# EAGLE design RH010.1 (EAGLE 7.1.0)
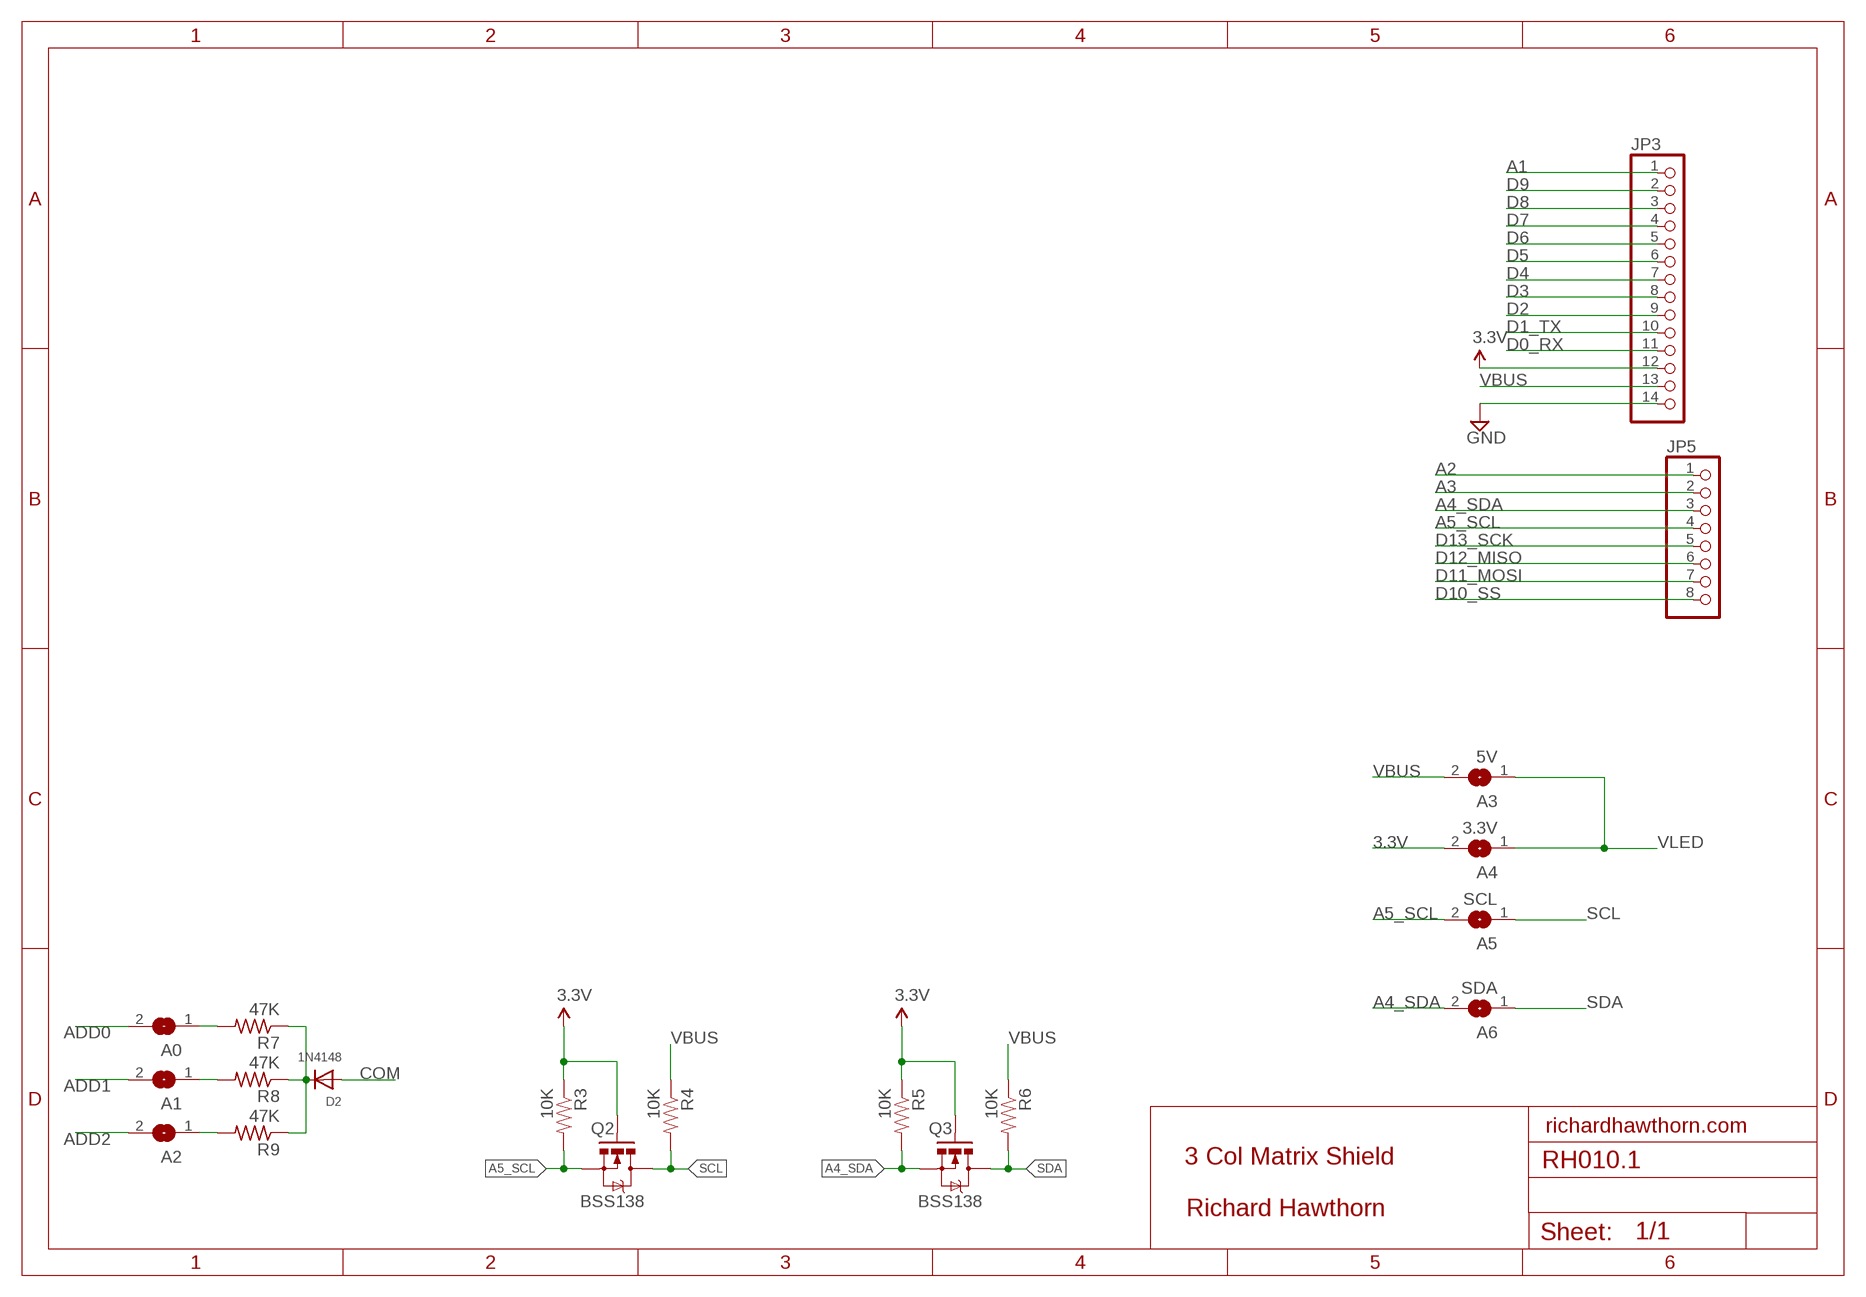
[diagram p0: schematic, sheet 1, part 1 of 2]
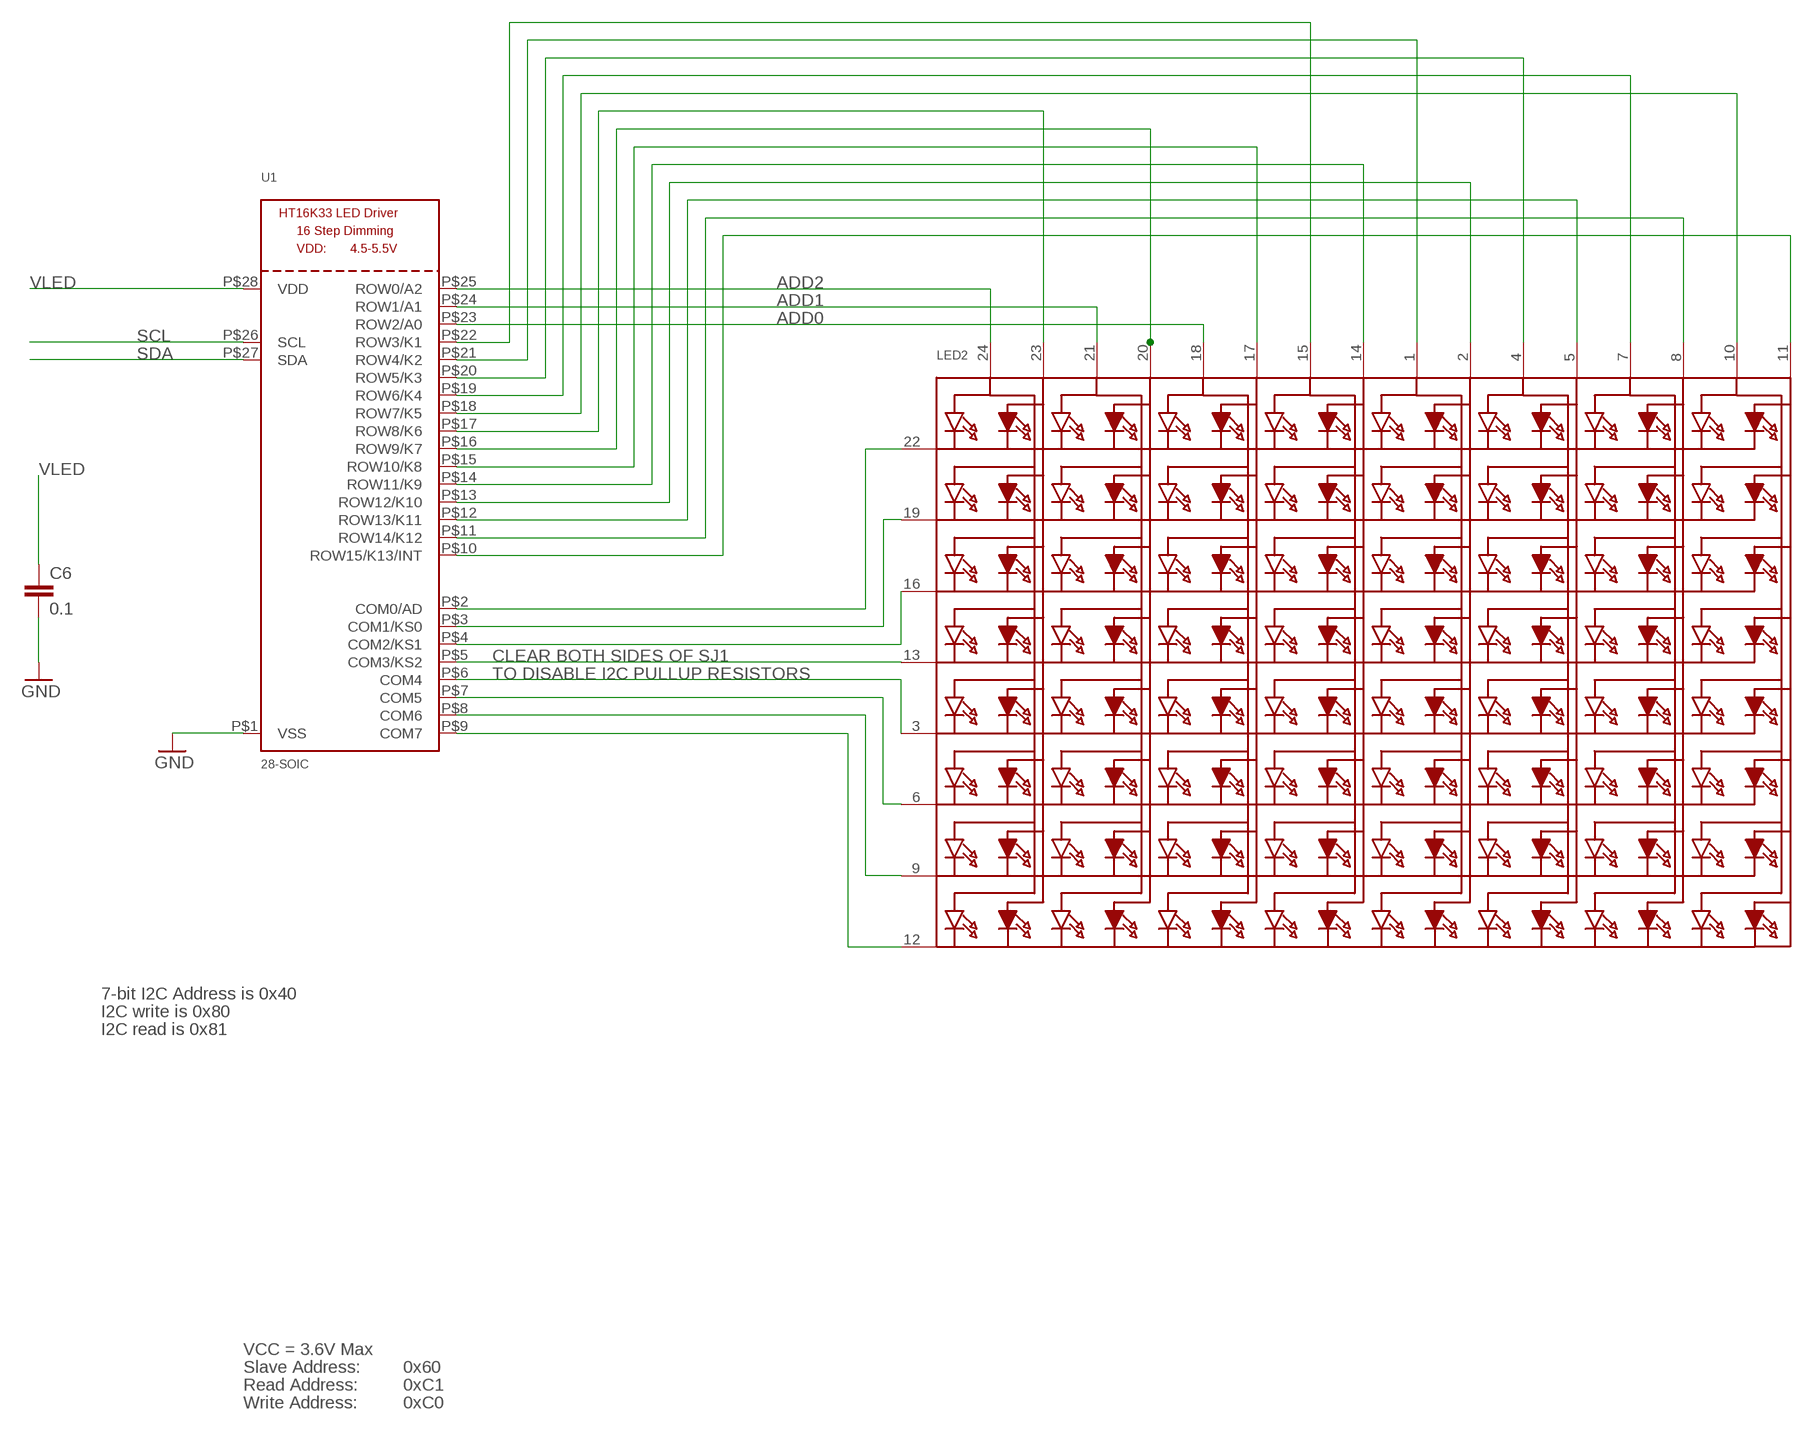
[diagram p1: schematic, sheet 1, part 2 of 2]

## Parts
A0  SOLDERJUMPERREFLOW_NOPASTE  [SOLDERJUMPER_REFLOW_NOPASTE]
A1  SOLDERJUMPERREFLOW_NOPASTE  [SOLDERJUMPER_REFLOW_NOPASTE]
A2  SOLDERJUMPERREFLOW_NOPASTE  [SOLDERJUMPER_REFLOW_NOPASTE]
A3  5V  SOLDERJUMPERREFLOW_NOPASTE  [SOLDERJUMPER_REFLOW_NOPASTE]
A4  3.3V  SOLDERJUMPERREFLOW_NOPASTE  [SOLDERJUMPER_REFLOW_NOPASTE]
A5  SCL  SOLDERJUMPERREFLOW_NOPASTE  [SOLDERJUMPER_REFLOW_NOPASTE]
A6  SDA  SOLDERJUMPERREFLOW_NOPASTE  [SOLDERJUMPER_REFLOW_NOPASTE]
C6  0.1  CAP0603-CAP  [0603-CAP]
D2  1N4148  DIODESOD-323F  [SOD-323F]
JP3  PINHD-1X14  [1X14]
JP5  PINHD-1X8  [1X08]
LED2  DISP_SEGMENT_8X8_BICOLOR_ROWCATHODEMI2A883XX  [SEGMENT_BICOL_BL-M12A883XX]
Q2  BSS138  MOSFET-NCHANNELSMD  [SOT23-3]
Q3  BSS138  MOSFET-NCHANNELSMD  [SOT23-3]
R3  10K  RESISTOR0603-RES  [0603-RES]
R4  10K  RESISTOR0603-RES  [0603-RES]
R5  10K  RESISTOR0603-RES  [0603-RES]
R6  10K  RESISTOR0603-RES  [0603-RES]
R7  47K  R-US_R0805  [R0805]
R8  47K  R-US_R0805  [R0805]
R9  47K  R-US_R0805  [R0805]
U1  28-SOIC  HT16K33_SOP28  [SOP28_300MIL]

## Nets
3.3V: A4.2 JP3.12 Q2.1(G) Q3.1(G) R3.1 R5.1
A1: JP3.1
A2: JP5.1
A3: JP5.2
A4_SDA: A6.2 JP5.3 Q3.2(S) R5.2
A5_SCL: A5.2 JP5.4 Q2.2(S) R3.2
ADD0: A0.2 LED2.18(A5) U1.P$23(ROW2/A0)
ADD1: A1.2 LED2.21(A3) U1.P$24(ROW1/A1)
ADD2: A2.2 LED2.24(A1) U1.P$25(ROW0/A2)
COM: D2.A LED2.22(K1) U1.P$2(COM0/AD)
D0_RX: JP3.11
D1_TX: JP3.10
D2: JP3.9
D3: JP3.8
D4: JP3.7
D5: JP3.6
D6: JP3.5
D7: JP3.4
D8: JP3.3
D9: JP3.2
D10_SS: JP5.8
D11_MOSI: JP5.7
D12_MISO: JP5.6
D13_SCK: JP5.5
GND [power]: C6.2 JP3.14 U1.P$1(VSS)
N$1: LED2.12(K8) U1.P$9(COM7)
N$2: LED2.9(K7) U1.P$8(COM6)
N$3: LED2.6(K6) U1.P$7(COM5)
N$5: A0.1 R7.2
N$7: LED2.3(K5) U1.P$6(COM4)
N$8: LED2.13(K4) U1.P$5(COM3/KS2)
N$9: LED2.16(K3) U1.P$4(COM2/KS1)
N$10: LED2.19(K2) U1.P$3(COM1/KS0)
N$12: LED2.8(A14) U1.P$11(ROW14/K12)
N$13: LED2.5(A12) U1.P$12(ROW13/K11)
N$15: LED2.10(A15) U1.P$18(ROW7/K5)
N$16: LED2.7(A13) U1.P$19(ROW6/K4)
N$17: D2.C R7.1 R8.1 R9.1
N$18: A2.1 R9.2
N$19: A1.1 R8.2
N$20: LED2.1(A9) U1.P$21(ROW4/K2)
N$21: LED2.11(A16) U1.P$10(ROW15/K13/INT)
N$26: LED2.15(A7) U1.P$22(ROW3/K1)
N$35: LED2.4(A11) U1.P$20(ROW5/K3)
N$38: LED2.23(A2) U1.P$17(ROW8/K6)
N$39: LED2.20(A4) U1.P$16(ROW9/K7)
N$40: LED2.14(A8) U1.P$14(ROW11/K9)
N$41: LED2.17(A6) U1.P$15(ROW10/K8)
N$42: LED2.2(A10) U1.P$13(ROW12/K10)
SCL: A5.1 Q2.3(D) R4.2 U1.P$26(SCL)
SDA: A6.1 Q3.3(D) R6.2 U1.P$27(SDA)
VBUS [power]: A3.2 JP3.13 R4.1 R6.1
VLED [power]: A3.1 A4.1 C6.1 U1.P$28(VDD)

## Notes on the sheet
- CLEAR BOTH SIDES OF SJ1
- TO DISABLE I2C PULLUP RESISTORS
- 7-bit I2C Address is 0x40
- I2C write is 0x80
- I2C read is 0x81
- richardhawthorn.com
- 3 Col Matrix Shield
- Richard Hawthorn
- VCC = 3.6V Max
- Slave Address: | 0x60
- Read Address: | 0xC1
- Write Address: | 0xC0

## Library data of the parts
A0 A1-A6 = microbuilder:SOLDERJUMPER: SMD Solder JUMPER Solder the two pads together to create a connection, or remove the solder to break it. REFLOW - Use this footprint for solder paste and reflow ovens. WAVE - Use this footprint for hand-soldering (larger pads). CLOSED - Has a trace between the two pads to ensure it is closed by default. The trace needs to be cut to disable the jumper, and can be closed again by creating a solder bridge between the two pads.
C6 = LowPowerLab:CAP: Capacitor Standard 0603 ceramic capacitor, and 0.1" leaded capacitor.
D2 = adafruit:DIODE: Diode SMADIODE - SMA Surface Mount Package 20V 1A Schottky Diode Digikey: 641-1014-6-ND DO-1N4148 - Through Hole Small Current Diode SOD-123 20V 1 A (.5mV Vf) Schottky Diode - Digikey: MBRX120TPMSCT-ND SOD-323 10V 570mA (.38mV Vf, 3ns) Schottky Diode - Digikey: ZLLS410CT-ND SOD-523 30V 30mA Schottky Diode (RB751S-40TE61) - Digikey: RB751S-40TE61CT-ND SOT23-R/W - SOT23 Package (R = Solder Paste/Reflow Ovens, W = Hand-Soldering) BAT54Film 40V 300mA - Digikey: 497-7162-1-ND
JP3 = pinhead:PINHD-1X14: PIN HEADER
JP5 = pinhead:PINHD-1X8: PIN HEADER
LED2 = microbuilder:DISP_SEGMENT_8X8_BICOLOR_ROWCATHODE: 8x8 Bi-Color LED Segment Displays: Row = Cathode 1.2" Bi-Color 8x8 Matrix, 3.0mm Square LEDs - BL-M12A883XX
Q2 Q3 = SparkFun:MOSFET-NCHANNEL
R3-R6 = SparkFun:RESISTOR: Resistor Basic schematic elements and footprints for 0603, 1206, and PTH resistors.
R7-R9 = adafruit:R-US_: RESISTOR, American symbol
U1 = microbuilder:HT16K33_SOP28

## Net classes
1 power: width 0.381 mm, clearance 0.254 mm

## Board
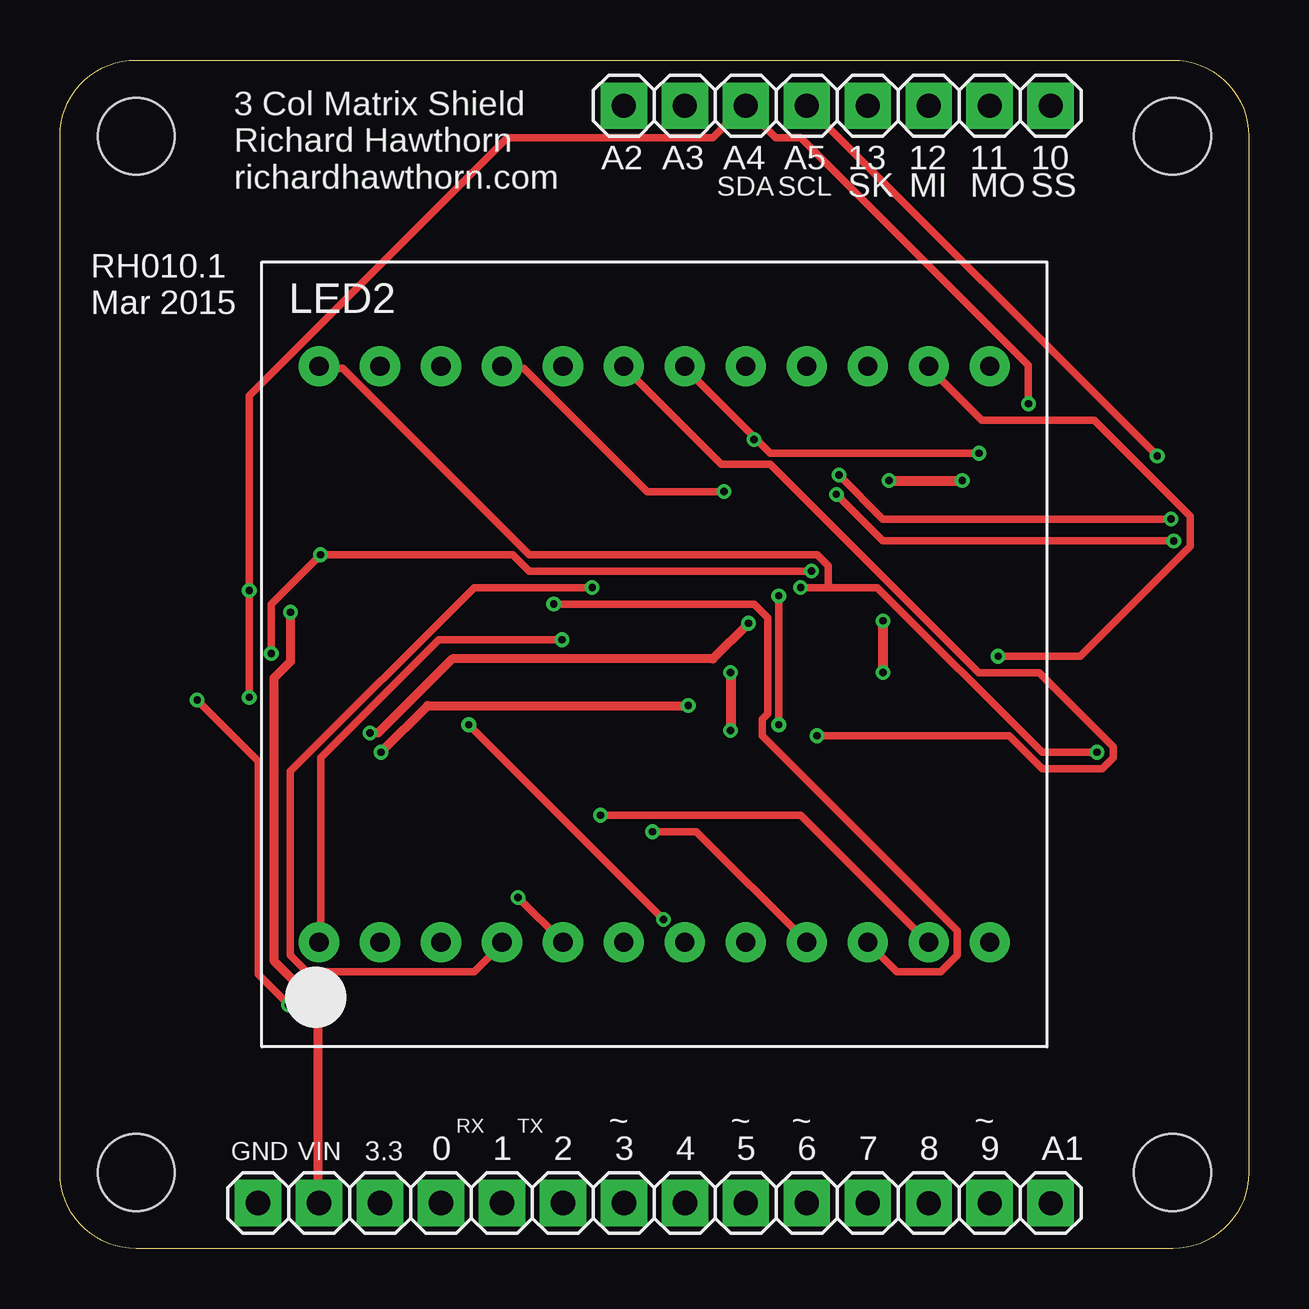
[diagram p2: board, top side]
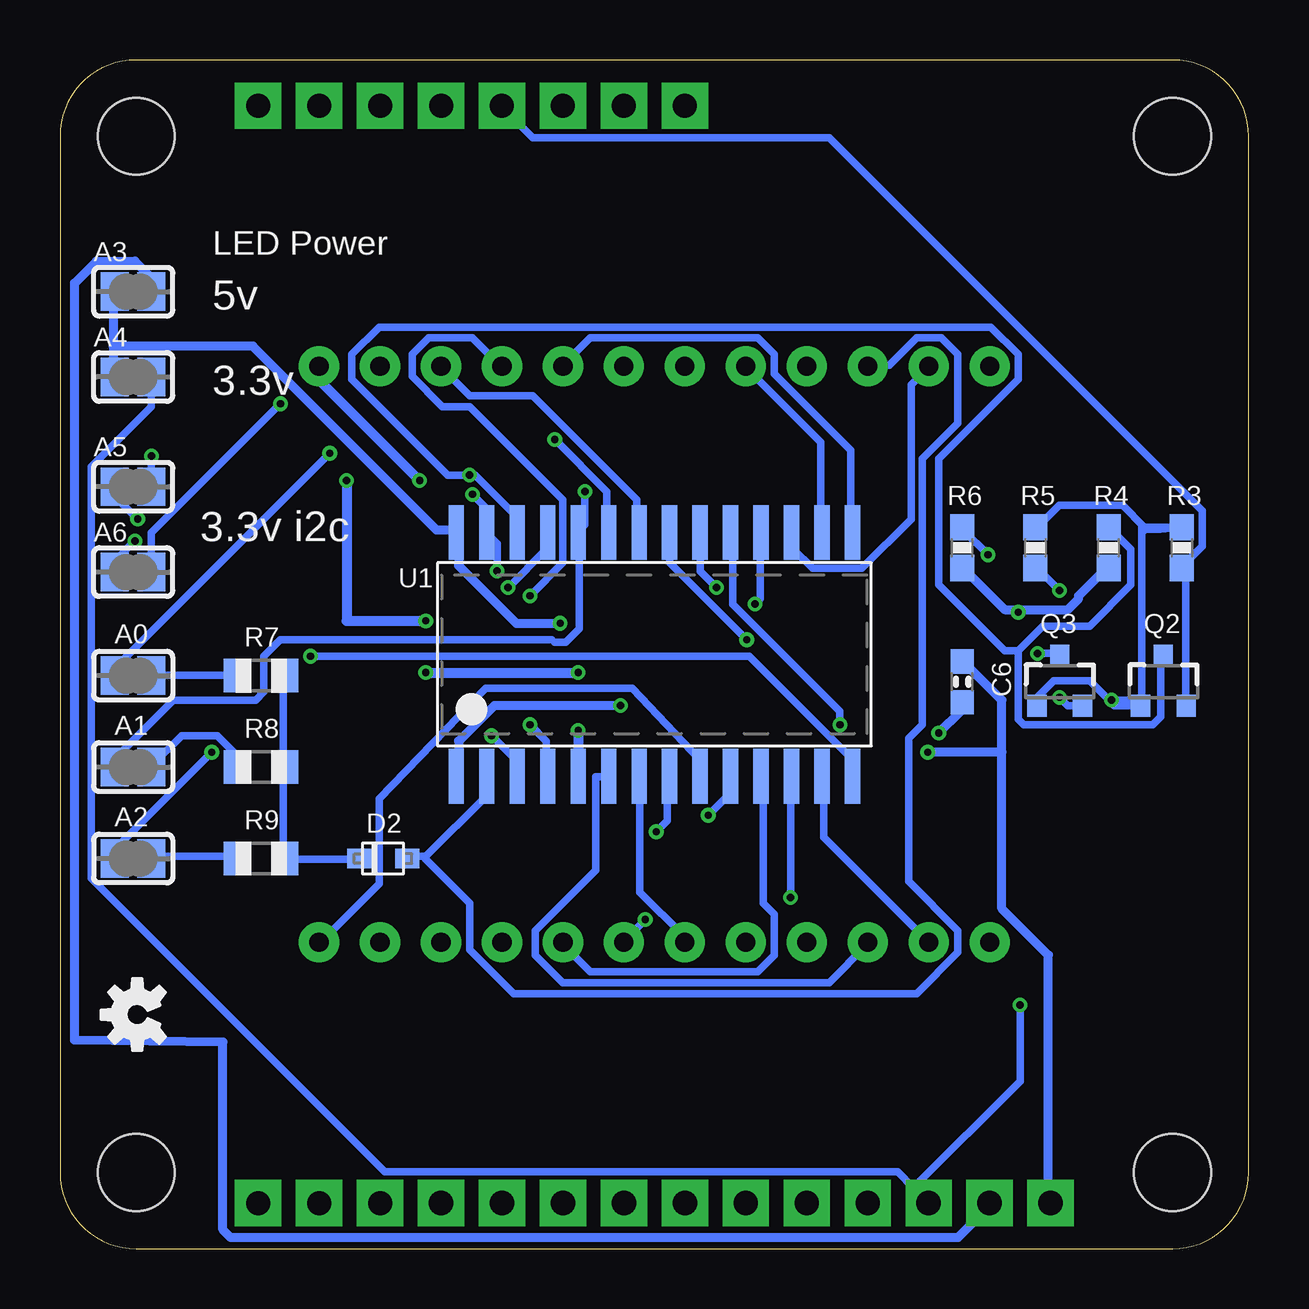
[diagram p3: board, bottom side, seen from below]

Size 49.53 x 49.53 mm. Coordinates in mm from the lower left corner, seen from the top.
Outline: 0,3.17 0,46.35 arc-90 3.17,49.53 46.35,49.53 arc-90 49.53,46.35 49.53,3.17 arc-90 46.35,0 3.17,0 arc-90 0,3.17
Copper layers (1*16): Top 0.035mm / dielectric 1.5mm / Bottom 0.035mm
Design rules "ITEADstudio_DRC *": minimum track width 12mil, minimum drill 12mil, track to track 6mil, track to pad 6mil, pad to pad 6mil, via to via 6mil, smd to smd 0mil, copper to edge 10mil, drill to drill 10mil, minimum pad ring 10mil, minimum via ring 6mil, stop-mask expansion 2mil, vias tented up to drill 100mil, thermal gap 15mil
Holes 3.2 mm at 3.17,3.17 46.35,3.17 3.17,46.35 46.35,46.35
tKeepout: area 0,0 to 5.7,5.7; area 43.8,0 to 49.5,5.7; area 43.8,43.8 to 49.5,49.5; area 0,43.8 to 5.7,49.5
bKeepout: area 0,43.8 to 5.7,49.5; area 43.8,43.8 to 49.5,49.5; area 43.8,0 to 49.5,5.7; area 0,0 to 5.7,5.7
tRestrict: area 24.3,8.9 to 29.1,12.8; area 5.8,16.9 to 6.9,18.5; area 5.2,9.7 to 6.7,10.4
bRestrict: area 27.4,17.7 to 29.2,18.7; area 21.1,13.8 to 22.9,14.9; area 21.6,12.6 to 22.1,13.2; area 20.7,12.6 to 21.2,13.2; area 20.2,12.8 to 20.7,13.5; area 20.1,13.4 to 20.6,14; area 26.5,18.9 to 27.1,19.5; area 26.5,17.9 to 27.1,18.5; area 27.5,19.1 to 28,19.8; area 27.9,18.8 to 29.1,19.6

### Footprints (pad centres in the part's own frame; a part is rotated, then mirrored left to right if it is on the bottom)
SOLDERJUMPER_REFLOW_NOPASTE = smd 1.168 x 1.6: 1 -0.762,0; 2 0.762,0
0603-CAP = smd 1.016 x 0.965: 1 -0.85,0; 2 0.85,0
SOD-323F = smd 1 x 0.8: A -1,0; C 1,0
1X14 = drill 1 pad 1.93 square: 1 -16.51,0; 2 -13.97,0; 3 -11.43,0 | drill 1.016 pad 1.93 square: 4 -8.89,0; 5 -6.35,0; 6 -3.81,0; 7 -1.27,0; 8 1.27,0; 9 3.81,0; 10 6.35,0; 11 8.89,0; 12 11.43,0; 13 13.97,0; 14 16.51,0
1X08 = drill 1 pad 1.93 square: 1 -8.89,0; 2 -6.35,0; 3 -3.81,0; 4 -1.27,0; 5 1.27,0; 6 3.81,0; 7 6.35,0; 8 8.89,0
SEGMENT_BICOL_BL-M12A883XX = drill 0.8 pad 1.676: 1 -13.97,-12; 2 -11.43,-12; 3 -8.89,-12; 4 -6.35,-12; 5 -3.81,-12; 6 -1.27,-12; 7 1.27,-12; 8 3.81,-12; 9 6.35,-12; 10 8.89,-12; 11 11.43,-12; 12 13.97,-12; 13 13.97,12; 14 11.43,12; 15 8.89,12; 16 6.35,12; 17 3.81,12; 18 1.27,12; 19 -1.27,12; 20 -3.81,12; 21 -6.35,12; 22 -8.89,12; 23 -11.43,12; 24 -13.97,12
SOT23-3 = smd 0.8 x 0.9: 1 -0.95,-1; 2 0.95,-1; 3 0,1.1
0603-RES = smd 1.1 x 1: 1 -0.85,0; 2 0.85,0
R0805 = smd 1.1 x 1.4: 1 -1,0; 2 1,0
SOP28_300MIL = smd 0.635 x 2.286: P$1 -8.255,-5.08; P$2 -6.985,-5.08; P$3 -5.715,-5.08; P$4 -4.445,-5.08; P$5 -3.175,-5.08; P$6 -1.905,-5.08; P$7 -0.635,-5.08; P$8 0.635,-5.08; P$9 1.905,-5.08; P$10 3.175,-5.08; P$11 4.445,-5.08; P$12 5.715,-5.08; P$13 6.985,-5.08; P$14 8.255,-5.08; P$15 8.255,5.08; P$16 6.985,5.08; P$17 5.715,5.08; P$18 4.445,5.08; P$19 3.175,5.08; P$20 1.905,5.08; P$21 0.635,5.08; P$22 -0.635,5.08; P$23 -1.905,5.08; P$24 -3.175,5.08; P$25 -4.445,5.08; P$26 -5.715,5.08; P$27 -6.985,5.08; P$28 -8.255,5.08

### Placement (x,y rotation side)
A0  46.48,23.88 180 bottom
A1  46.48,20.07 180 bottom
A2  46.48,16.26 180 bottom
A3  46.48,39.88 0 bottom
A4  46.48,36.32 0 bottom
A5  46.48,31.75 0 bottom
A6  46.48,28.19 0 bottom
C6  11.94,23.62 90 bottom
D2  36.07,16.26 180 bottom
JP3  24.77,1.91 180 top
JP5  32.38,47.62 0 top
LED2  24.77,24.77 0 top
Q2  3.56,23.62 0 bottom
Q3  7.87,23.62 0 bottom
R3  2.79,29.21 270 bottom
R4  5.84,29.21 90 bottom
R5  8.89,29.21 270 bottom
R6  11.94,29.21 90 bottom
R7  41.15,23.88 180 bottom
R8  41.15,20.07 180 bottom
R9  41.15,16.26 180 bottom
U1  24.77,24.77 0 bottom
U$3  [OSHW-LOGO-S]  46.32,9.75 90 bottom

### Tracks (layer width: path | path; a pad name or v marks a point on that pad's centre or on a via)
3.3V  (via drill 0.3)
  Top 0.305: v5.71,22.86 8.26,20.32 8.26,11.43 v9.53,10.16
  Bottom 0.305: A4.2 45.72,35.09 48.23,32.58 48.23,15.43 36.01,3.2 14.63,3.2 13.97,2.54 | 4.57,22.63 5.6,22.63 5.77,22.8 | 5.77,22.8 6.63,23.66 8.12,23.66 8.8,22.97 8.8,22.63 Q3.1 | 4.34,30.06 2.86,30.06 | 4.34,30.06 5.26,30.98 7.89,30.98 8.8,30.06 R5.1 | 4.46,29.84 4.46,30.06 4.34,30.06 | 4.46,29.84 4.46,22.86 | 4.46,22.86 4.46,22.75 | 4.46,22.86 4.45,22.86 Q2.1 | 4.46,22.86 v5.71,22.86 5.77,22.8 | R3.1 3.68,29.97 4.32,29.97 4.45,29.84 4.46,29.84 | v9.53,10.16 9.53,6.99 13.97,2.54 | 13.97,2.54 JP3.12
A4_SDA  (via drill 0.3)
  Top 0.305: v7.89,22.97 v7.89,27.43 7.89,35.55 18.63,46.29 27.2,46.29 28.46,47.55 JP5.3 28.57,47.55 29.83,46.29 30.86,46.29 40.35,36.8 v40.35,35.2
  Bottom 0.305: v7.89,22.97 7.54,22.63 6.97,22.63 Q3.2 | v7.89,27.43 8.8,28.35 R5.2 | A6.2 45.72,29.83 v40.35,35.2
A5_SCL  (via drill 0.3)
  Top 0.305: v45.72,33.03 31.2,47.55 JP5.4
  Bottom 0.305: Q2.2 2.63,22.63 2.63,28.23 2.74,28.35 R3.2 2.74,28.46 1.94,29.26 1.94,30.75 17.49,46.29 29.83,46.29 31.09,47.55 JP5.4 | v45.72,33.03 A5.2
ADD0  (via drill 0.3)
  Top 0.305: v38.29,33.15 29.6,33.15 28.98,33.78 | 28.98,33.78 26.06,36.69 LED2.18 | v28.92,33.72 28.98,33.78
  Bottom 0.305: v38.29,33.15 47.21,24.23 47.21,23.89 A0.2 | v28.92,33.72 26.75,31.55 26.75,29.95 U1.P$23
ADD1  (via drill 0.3)
  Top 0.305: v27.66,31.55 24.46,31.55 19.32,36.69 18.52,36.69 LED2.21
  Bottom 0.305: A1.2 47.21,20.12 47.21,20.46 44.81,22.86 41.38,22.86 41.03,23.2 41.03,24.69 40.35,25.38 29.03,25.38 28.92,25.26 28.46,25.26 27.89,25.83 27.89,29.83 U1.P$24 27.89,29.95 27.66,30.18 v27.66,31.55
ADD2  (via drill 0.3)
  Top 0.305: v43.2,20.69 40.92,20.69 34.06,27.55 32,27.55 | v30.86,27.55 32,27.55 | 32,27.55 32,28.46 31.55,28.92 19.55,28.92 11.77,36.69 10.86,36.69 LED2.24
  Bottom 0.305: v43.2,20.69 47.21,16.69 47.21,16.34 A2.2 | v30.86,27.55 29.26,29.15 29.26,29.83 U1.P$25
COM
  Bottom 0.305: 34.29,16.34 34.98,16.34 D2.A | 34.29,16.34 31.77,18.86 31.77,19.66 U1.P$2 | LED2.22 15.77,36.8 14.97,36.8 13.83,37.95 12.8,37.95 12.12,37.26 12.12,34.4 13.6,32.92 13.6,21.83 14.17,21.26 14.17,15.32 12.12,13.26 12.12,12.34 13.83,10.63 30.63,10.63 32.46,12.46 32.46,14.4 34.29,16.23 34.29,16.34
GND  (via drill 0.3)
  Top 0.381: v26.18,22.63 15.32,22.63 v13.37,20.69
  Bottom 0.381: 10.29,20.69 10.29,14.17 8.34,12.23 8.34,1.94 JP3.14 | 10.29,20.69 10.29,22.86 11.89,24.46 C6.2 | v26.18,22.63 31.43,22.63 32.92,21.14 32.92,19.77 U1.P$1 | 10.29,20.69 v13.37,20.69
N$1
  Bottom 0.305: U1.P$9 22.86,20.34 25.69,23.34 31.8,23.34 36.23,18.75 36.23,15.2 38.63,12.8 LED2.12
N$2  (via drill 0.3)
  Top 0.305: v24.69,17.37 26.52,17.37 31.09,12.8 LED2.9
  Bottom 0.305: v24.69,17.37 24.23,17.83 24.23,19.66 U1.P$8
N$3
  Bottom 0.305: U1.P$7 25.38,19.66 25.38,14.86 23.55,13.03 23.55,12.8 LED2.6
N$5
  Bottom 0.305: R7.2 42.18,23.89 A0.1
N$7
  Bottom 0.305: U1.P$6 26.75,19.66 27.2,19.66 27.2,15.77 29.72,13.26 29.72,12.23 28.57,11.09 17.49,11.09 15.89,12.69 LED2.3
N$8  (via drill 0.3)
  Top 0.406: v34.54,32 v37.59,32 | v34.29,26.16 v34.29,24 | v27.94,24 v27.94,21.59
  Bottom 0.406: LED2.13 38.61,36.07 v34.54,32 | v37.59,32 37.59,26.16 v34.29,26.16 | v34.29,24 v27.94,24 | v27.94,21.59 U1.P$5
N$9  (via drill 0.3)
  Top 0.305: v29.95,27.2 v29.95,21.83
  Bottom 0.305: v29.95,21.83 29.26,21.14 29.26,19.77 U1.P$4 | v29.95,27.2 28.57,28.57 28.57,31.2 32.46,35.09 33.6,35.09 34.86,36.35 34.86,37.26 34.18,37.95 32.35,37.95 31.2,36.8 LED2.16
N$10  (via drill 0.3)
  Top 0.305: v31.55,21.37 39.55,21.37 40.92,20 43.43,20 43.89,20.46 43.89,20.92 40.8,24 38.29,24 29.6,32.69 27.55,32.69 23.55,36.69 LED2.19
  Bottom 0.305: v31.55,21.37 30.52,20.34 30.52,19.77 U1.P$3
N$12
  Bottom 0.305: U1.P$11 20.23,19.66 20.23,14.4 19.77,13.95 19.77,12.23 20.46,11.54 27.43,11.54 28.57,12.69 LED2.8
N$13  (via drill 0.3)
  Top 0.305: v19.09,14.63 20.92,12.8 LED2.5
  Bottom 0.305: v19.09,14.63 19.09,19.66 U1.P$12
N$15  (via drill 0.3)
  Top 0.305: v20.57,26.86 28.92,26.86 29.49,26.29 29.49,22.29 29.26,22.06 29.26,21.37 37.38,13.26 37.38,12.23 36.69,11.54 34.86,11.54 33.72,12.69 LED2.10
  Bottom 0.305: v20.57,26.86 20.34,27.09 20.34,29.83 U1.P$18
N$16  (via drill 0.3)
  Top 0.305: v25.15,13.72 v17.03,21.83
  Bottom 0.305: v17.03,21.83 17.03,22.4 21.49,26.86 21.49,29.83 U1.P$19 | v25.15,13.72 26.06,12.8 LED2.7
N$17
  Bottom 0.305: D2.C 37.15,16.23 40.12,16.23 R9.1 40.23,16.34 40.23,20 R8.1 40.23,20.12 40.23,23.77 R7.1
N$18
  Bottom 0.305: R9.2 42.18,16.34 45.72,16.34 A2.1
N$19
  Bottom 0.305: R8.2 42.18,20.12 42.18,20.57 42.98,21.37 44.46,21.37 45.72,20.12 A1.1
N$20  (via drill 0.3)
  Top 0.305: v20.92,25.38 15.77,25.38 10.86,20.46 10.86,12.8 LED2.1
  Bottom 0.305: v20.92,25.38 24.12,28.57 24.12,29.83 U1.P$21
N$21  (via drill 0.3)
  Top 0.305: v22.52,18.06 30.86,18.06 36.12,12.8 LED2.11
  Bottom 0.305: v22.52,18.06 21.6,18.97 21.6,19.66 U1.P$10
N$26
  Bottom 0.305: U1.P$22 25.49,29.95 25.49,31.2 29.83,35.55 32.46,35.55 33.6,36.69 LED2.15
N$35  (via drill 0.3)
  Top 0.305: v22.17,27.55 17.26,27.55 9.6,19.89 9.6,12.23 10.29,11.54 17.26,11.54 18.4,12.69 LED2.4
  Bottom 0.305: U1.P$20 22.86,28.23 v22.17,27.55
N$38
  Bottom 0.305: U1.P$17 18.97,29.83 18.97,29.15 18.17,28.35 16.12,28.35 14.06,30.4 14.06,36.01 13.37,36.69 LED2.23
N$39
  Bottom 0.305: U1.P$16 17.83,29.95 17.83,33.6 20.92,36.69 LED2.20
N$40  (via drill 0.3)
  Top 0.305: v39.09,24.69 42.52,24.69 47.09,29.26 47.09,30.52 43.09,34.52 38.41,34.52 36.23,36.69 LED2.14
  Bottom 0.305: v39.09,24.69 20.8,24.69 16.57,20.46 16.57,19.77 U1.P$14
N$41
  Bottom 0.305: U1.P$15 16.57,29.95 16.57,33.26 19.77,36.46 19.77,37.26 20.46,37.95 27.43,37.95 28.57,36.8 LED2.17
N$42
  Bottom 0.305: U1.P$13 17.72,19.66 17.72,17.14 13.37,12.8 LED2.2
SCL  (via drill 0.3)
  Top 0.305: v46.29,30.4 34.29,30.4 v32.46,32.23
  Bottom 0.305: 9.6,24.92 9.6,22.06 9.37,21.83 4,21.83 3.66,22.17 3.66,24.69 Q2.3 | 9.6,24.92 8.57,25.95 6.63,25.95 4.92,27.66 4.92,29.15 5.83,30.06 R4.2 | v46.29,30.4 47.21,31.32 47.21,31.66 A5.1 | U1.P$26 30.52,29.95 30.52,30.52 32.23,32.23 v32.46,32.23 33.38,32.23 37.38,36.23 37.38,37.26 36.23,38.41 10.74,38.41 9.6,37.26 9.6,36.23 12.92,32.92 12.92,27.66 10.17,24.92 9.6,24.92
SDA  (via drill 0.3)
  Top 0.305: v8.8,24.8 8.8,26.86 v10.86,28.92 18.86,28.92 19.55,28.23 v31.32,28.23 | v46.41,29.49 34.29,29.49 v32.35,31.43
  Bottom 0.305: v8.8,24.8 7.89,24.8 Q3.3 | v10.86,28.92 11.89,29.95 R6.2 | v46.41,29.49 47.21,28.69 47.21,28.23 A6.1 | v32.35,31.43 31.77,30.86 31.77,29.95 U1.P$27 31.66,29.72 31.32,29.38 v31.32,28.23
VBUS  (via drill 0.3)
  Top 0.381: v9.6,26.52 9.6,24.46 8.91,23.77 8.91,12 10.74,10.17 10.74,1.94 JP3.13
  Bottom 0.381: 9.6,26.63 10.17,26.63 11.89,28.35 R6.1 | 9.6,26.63 7.54,26.63 7.09,27.09 7.09,27.2 5.94,28.35 R4.1 | JP3.13 10.74,1.83 12.12,0.46 42.41,0.46 42.75,0.8 42.75,8.61 48.92,8.69 48.92,40.23 48.01,41.15 46.41,41.15 45.72,40.46 A3.2 | v9.6,26.52 9.6,26.63
VLED  (via drill 0.3)
  Top 0.381: v12.92,21.49 13.26,21.49 16.34,24.57 27.2,24.57 v28.69,26.06
  Bottom 0.381: 47.32,37.6 47.32,39.78 A3.1 | 47.32,37.6 47.32,36.35 A4.1 | v12.92,21.49 12,22.4 12,22.75 C6.1 | v28.69,26.06 30.52,26.06 32.92,28.46 32.92,29.83 U1.P$28 33.15,29.95 33.83,29.95 41.49,37.6 47.32,37.6

### Text on the board
tNames: A2 | A3 | A4 | A5 | 13 | 12 | 11 | 10 | 3 Col Matrix Shield / Richard Hawthorn / richardhawthorn.com | SDA | SCL | SK | MI | MO | SS | RH010.1 / Mar 2015 | RX | TX | ~ | ~ | ~ | ~ | GND | VIN | 3.3 | 0 | 1 | 2 | 3 | 4 | 5 | 6 | 7 | 8 | 9 | A1
bNames: LED Power | 5v | 3.3v | 3.3v i2c
tDocu: REG